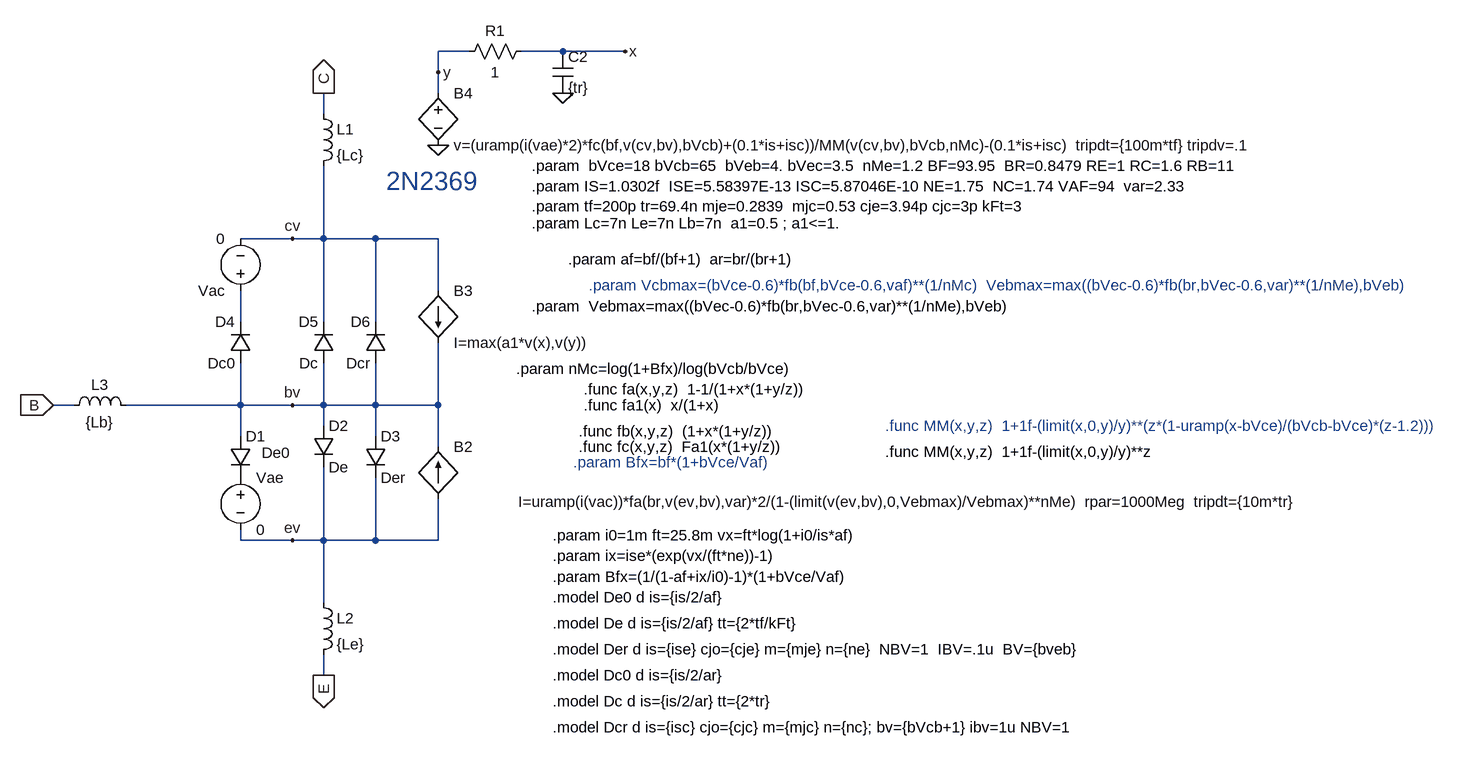
[diagram p0: schematic 2N2369A_Avalanche.asc]
2N2369A_Avalanche.asc, the LTspice schematic file:
Version 4
SHEET 1 4432 812
WIRE 1184 -464 1136 -464
WIRE 1328 -464 1264 -464
WIRE 1424 -464 1328 -464
WIRE 1136 -432 1136 -464
WIRE 1136 -400 1136 -432
WIRE 960 -368 960 -400
WIRE 912 -176 832 -176
WIRE 960 -176 960 -288
WIRE 960 -176 912 -176
WIRE 1040 -176 960 -176
WIRE 1136 -176 1040 -176
WIRE 1136 -96 1136 -176
WIRE 832 -48 832 -96
WIRE 960 -48 960 -176
WIRE 1040 -48 1040 -176
WIRE 576 80 544 80
WIRE 832 80 832 16
WIRE 832 80 656 80
WIRE 912 80 832 80
WIRE 960 80 960 16
WIRE 960 80 912 80
WIRE 1040 80 1040 16
WIRE 1040 80 960 80
WIRE 1136 80 1136 -16
WIRE 1136 80 1040 80
WIRE 960 112 960 80
WIRE 832 128 832 80
WIRE 1040 128 1040 80
WIRE 1136 144 1136 80
WIRE 832 288 832 272
WIRE 912 288 832 288
WIRE 960 288 960 176
WIRE 960 288 912 288
WIRE 1040 288 1040 192
WIRE 1040 288 960 288
WIRE 1136 288 1136 224
WIRE 1136 288 1040 288
WIRE 960 384 960 288
WIRE 960 496 960 464
FLAG 960 -400 C
IOPIN 960 -400 Out
FLAG 960 496 E
IOPIN 960 496 Out
FLAG 544 80 B
IOPIN 544 80 In
FLAG 912 80 bv
FLAG 912 -176 cv
FLAG 912 288 ev
FLAG 1136 -320 0
FLAG 1328 -400 0
FLAG 1424 -464 x
FLAG 1136 -432 y
SYMBOL diode 816 128 R0
WINDOW 3 49 25 Left 2
SYMATTR Value De0
SYMATTR InstName D1
SYMBOL diode 944 112 R0
SYMATTR InstName D2
SYMATTR Value De
SYMBOL diode 1024 128 R0
SYMATTR InstName D3
SYMATTR Value Der
SYMBOL voltage 832 176 R0
WINDOW 123 0 0 Left 2
WINDOW 39 0 0 Left 2
SYMATTR InstName Vae
SYMATTR Value 0
SYMBOL diode 848 16 R180
WINDOW 0 24 64 Left 2
WINDOW 3 24 0 Left 2
SYMATTR InstName D4
SYMATTR Value Dc0
SYMBOL voltage 832 -80 R180
WINDOW 123 0 0 Left 2
WINDOW 39 0 0 Left 2
SYMATTR InstName Vac
SYMATTR Value 0
SYMBOL diode 976 16 R180
WINDOW 0 24 64 Left 2
WINDOW 3 24 0 Left 2
SYMATTR InstName D5
SYMATTR Value Dc
SYMBOL diode 1056 16 R180
WINDOW 0 24 64 Left 2
WINDOW 3 24 0 Left 2
SYMATTR InstName D6
SYMATTR Value Dcr
SYMBOL bi 1136 224 M180
WINDOW 0 24 80 Left 2
WINDOW 3 123 -5 Left 2
SYMATTR InstName B2
SYMATTR Value I=uramp(i(vac))*fa(br,v(ev,bv),var)*2/(1-(limit(v(ev,bv),0,Vebmax)/Vebmax)**nMe)  rpar=1000Meg  tripdt={10m*tr}
SYMBOL ind 944 -384 R0
SYMATTR InstName L1
SYMATTR Value {Lc}
SYMATTR SpiceLine Rser={Rc} Rpar={Rc*100}
SYMBOL ind 944 368 R0
SYMATTR InstName L2
SYMATTR Value {Le}
SYMATTR SpiceLine Rser={Re} Rpar={Re*100}
SYMBOL ind 560 96 R270
WINDOW 0 32 56 VTop 2
WINDOW 3 5 56 VBottom 2
SYMATTR InstName L3
SYMATTR Value {Lb}
SYMATTR SpiceLine Rser={Rb} Rpar={Rb*100}
SYMBOL cap 1312 -464 R0
SYMATTR InstName C2
SYMATTR Value {tr}
SYMATTR SpiceLine Rser=0
SYMBOL bi 1136 -96 R0
SYMATTR InstName B3
SYMATTR Value I=max(a1*v(x),v(y))
SYMBOL bv 1136 -416 R0
SYMATTR InstName B4
SYMATTR Value v=(uramp(i(vae)*2)*fc(bf,v(cv,bv),bVcb)+(0.1*is+isc))/MM(v(cv,bv),bVcb,nMc)-(0.1*is+isc)  tripdt={100m*tf} tripdv=.1
SYMBOL res 1280 -480 R90
WINDOW 0 0 56 VBottom 2
WINDOW 3 32 56 VTop 2
SYMATTR InstName R1
SYMATTR Value 1
TEXT 1312 376 Left 2 !.model De0 d is={is/2/af}
TEXT 1312 416 Left 2 !.model De d is={is/2/af} tt={2*tf/kFt}
TEXT 1312 456 Left 2 !.model Der d is={ise} cjo={cje} m={mje} n={ne}  NBV=1  IBV=.1u  BV={bveb}
TEXT 1312 496 Left 2 !.model Dc0 d is={is/2/ar}
TEXT 1312 536 Left 2 !.model Dc d is={is/2/ar} tt={2*tr}
TEXT 1312 576 Left 2 !.model Dcr d is={isc} cjo={cjc} m={mjc} n={nc}; bv={bVcb+1} ibv=1u NBV=1
TEXT 1336 -144 Left 2 !.param af=bf/(bf+1)  ar=br/(br+1)
TEXT 1368 -104 Left 2 ;.param Vcbmax=(bVce-0.6)*fb(bf,bVce-0.6,vaf)**(1/nMc)  Vebmax=max((bVec-0.6)*fb(br,bVec-0.6,var)**(1/nMe),bVeb)
TEXT 1280 -288 Left 2 !.param  bVce=18 bVcb=65  bVeb=4. bVec=3.5  nMe=1.2 BF=93.95  BR=0.8479 RE=1 RC=1.6 RB=11\n.param IS=1.0302f  ISE=5.58397E-13 ISC=5.87046E-10 NE=1.75  NC=1.74 VAF=94  var=2.33\n.param tf=200p tr=69.4n mje=0.2839  mjc=0.53 cje=3.94p cjc=3p kFt=3
TEXT 1056 -264 Left 4 ;2N2369
TEXT 1360 80 Left 2 !.func fa1(x)  x/(1+x)
TEXT 1352 120 Left 2 !.func fb(x,y,z)  (1+x*(1+y/z))
TEXT 1280 -200 Left 2 !.param Lc=7n Le=7n Lb=7n  a1=0.5 ; a1<=1.
TEXT 1312 280 Left 2 !.param i0=1m ft=25.8m vx=ft*log(1+i0/is*af)
TEXT 1312 312 Left 2 !.param ix=ise*(exp(vx/(ft*ne))-1)
TEXT 1312 344 Left 2 !.param Bfx=(1/(1-af+ix/i0)-1)*(1+bVce/Vaf)
TEXT 1280 -72 Left 2 !.param  Vebmax=max((bVec-0.6)*fb(br,bVec-0.6,var)**(1/nMe),bVeb)
TEXT 1256 24 Left 2 !.param nMc=log(1+Bfx)/log(bVcb/bVce)
TEXT 1344 168 Left 2 ;.param Bfx=bf*(1+bVce/Vaf)
TEXT 1360 56 Left 2 !.func fa(x,y,z)  1-1/(1+x*(1+y/z))
TEXT 1824 112 Left 2 ;.func MM(x,y,z)  1+1f-(limit(x,0,y)/y)**(z*(1-uramp(x-bVce)/(bVcb-bVce)*(z-1.2)))
TEXT 1824 152 Left 2 !.func MM(x,y,z)  1+1f-(limit(x,0,y)/y)**z
TEXT 1352 144 Left 2 !.func fc(x,y,z)  Fa1(x*(1+y/z))

The netlist it stands for:
* 2N2369A_Avalanche.asc
D1 bv P001 De0
D2 bv ev De
D3 bv ev Der
Vae P001 ev 0
D4 bv N001 Dc0
Vac N001 cv 0
D5 bv cv Dc
D6 bv cv Dcr
B2 ev bv I=uramp(i(vac))*fa(br,v(ev,bv),var)*2/(1-(limit(v(ev,bv),0,Vebmax)/Vebmax)**nMe)  rpar=1000Meg  tripdt={10m*tr}
L1 C cv {Lc} Rser={Rc} Rpar={Rc*100}
L2 ev E {Le} Rser={Re} Rpar={Re*100}
L3 B bv {Lb} Rser={Rb} Rpar={Rb*100}
C2 x 0 {tr} Rser=0
B3 cv bv I=max(a1*v(x),v(y))
B4 y 0 v=(uramp(i(vae)*2)*fc(bf,v(cv,bv),bVcb)+(0.1*is+isc))/MM(v(cv,bv),bVcb,nMc)-(0.1*is+isc)  tripdt={100m*tf} tripdv=.1
R1 x y 1
.model D D
.lib standard.dio
.model De0 d is={is/2/af}
.model De d is={is/2/af} tt={2*tf/kFt}
.model Der d is={ise} cjo={cje} m={mje} n={ne}  NBV=1  IBV=.1u  BV={bveb}
.model Dc0 d is={is/2/ar}
.model Dc d is={is/2/ar} tt={2*tr}
.model Dcr d is={isc} cjo={cjc} m={mjc} n={nc}; bv={bVcb+1} ibv=1u NBV=1
.param af=bf/(bf+1)  ar=br/(br+1)
* .param Vcbmax=(bVce-0.6)*fb(bf,bVce-0.6,vaf)**(1/nMc)  Vebmax=max((bVec-0.6)*fb(br,bVec-0.6,var)**(1/nMe),bVeb)
.param  bVce=18 bVcb=65  bVeb=4. bVec=3.5  nMe=1.2 BF=93.95  BR=0.8479 RE=1 RC=1.6 RB=11
.param IS=1.0302f  ISE=5.58397E-13 ISC=5.87046E-10 NE=1.75  NC=1.74 VAF=94  var=2.33
.param tf=200p tr=69.4n mje=0.2839  mjc=0.53 cje=3.94p cjc=3p kFt=3
* 2N2369
.func fa1(x)  x/(1+x)
.func fb(x,y,z)  (1+x*(1+y/z))
.param Lc=7n Le=7n Lb=7n  a1=0.5 ; a1<=1.
.param i0=1m ft=25.8m vx=ft*log(1+i0/is*af)
.param ix=ise*(exp(vx/(ft*ne))-1)
.param Bfx=(1/(1-af+ix/i0)-1)*(1+bVce/Vaf)
.param  Vebmax=max((bVec-0.6)*fb(br,bVec-0.6,var)**(1/nMe),bVeb)
.param nMc=log(1+Bfx)/log(bVcb/bVce)
* .param Bfx=bf*(1+bVce/Vaf)
.func fa(x,y,z)  1-1/(1+x*(1+y/z))
* .func MM(x,y,z)  1+1f-(limit(x,0,y)/y)**(z*(1-uramp(x-bVce)/(bVcb-bVce)*(z-1.2)))
.func MM(x,y,z)  1+1f-(limit(x,0,y)/y)**z
.func fc(x,y,z)  Fa1(x*(1+y/z))
.backanno
.end